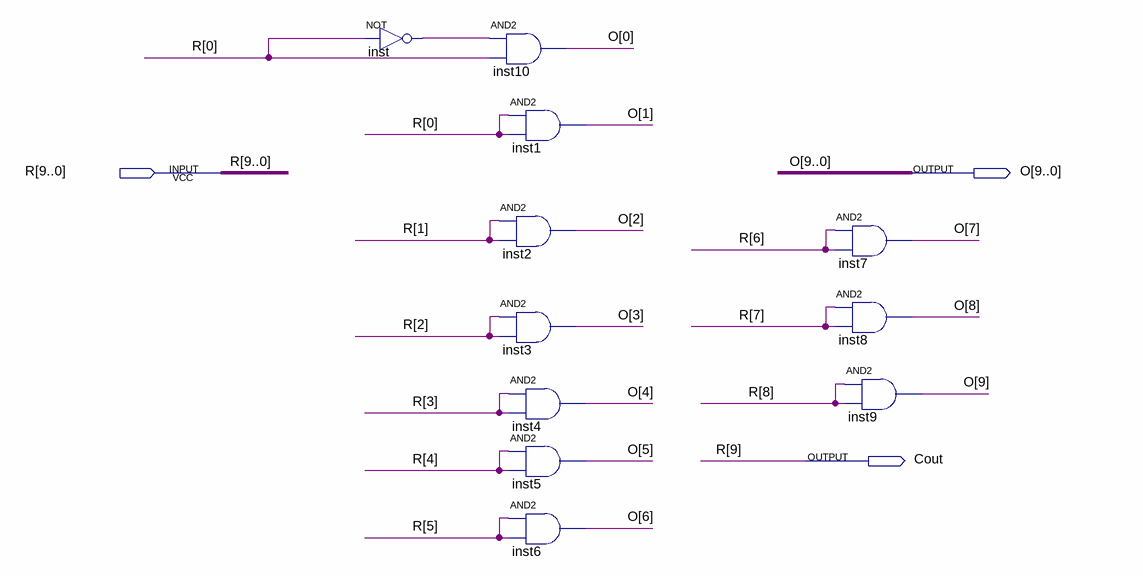
[diagram p0: schematic sheet]
// Quartus schematic 10-bitshiftcombo.bdf as structural Verilog: 11 symbols, 3 pins
module \10-bitshiftcombo  (
  input  [9:0] R,
  output [9:0] O,
  output Cout
);

  wire inst_out;

  not inst (inst_out, R[0]);
  and inst10 (O[0], inst_out, R[0]);
  and inst1 (O[1], R[0], R[0]);
  and inst2 (O[2], R[1], R[1]);
  and inst3 (O[3], R[2], R[2]);
  and inst4 (O[4], R[3], R[3]);
  and inst5 (O[5], R[4], R[4]);
  and inst6 (O[6], R[5], R[5]);
  and inst7 (O[7], R[6], R[6]);
  and inst8 (O[8], R[7], R[7]);
  and inst9 (O[9], R[8], R[8]);

  assign Cout = R[9];
endmodule
